# EasyEDA Pro project IoT_gateway_ver1A.epro

# Schematic Schematic

## Sheets
1 ESP32-S3-Mini-1U-N4R2: Board Name: Board1; Create Date: 2026-08-17; Page Name: P1; Project Name: ESP32-S3; Schematic Name: Schematic1; Update Date: 2026-08-17; Company: EasyEDA.com; Page Size: A4; Version: V1.0
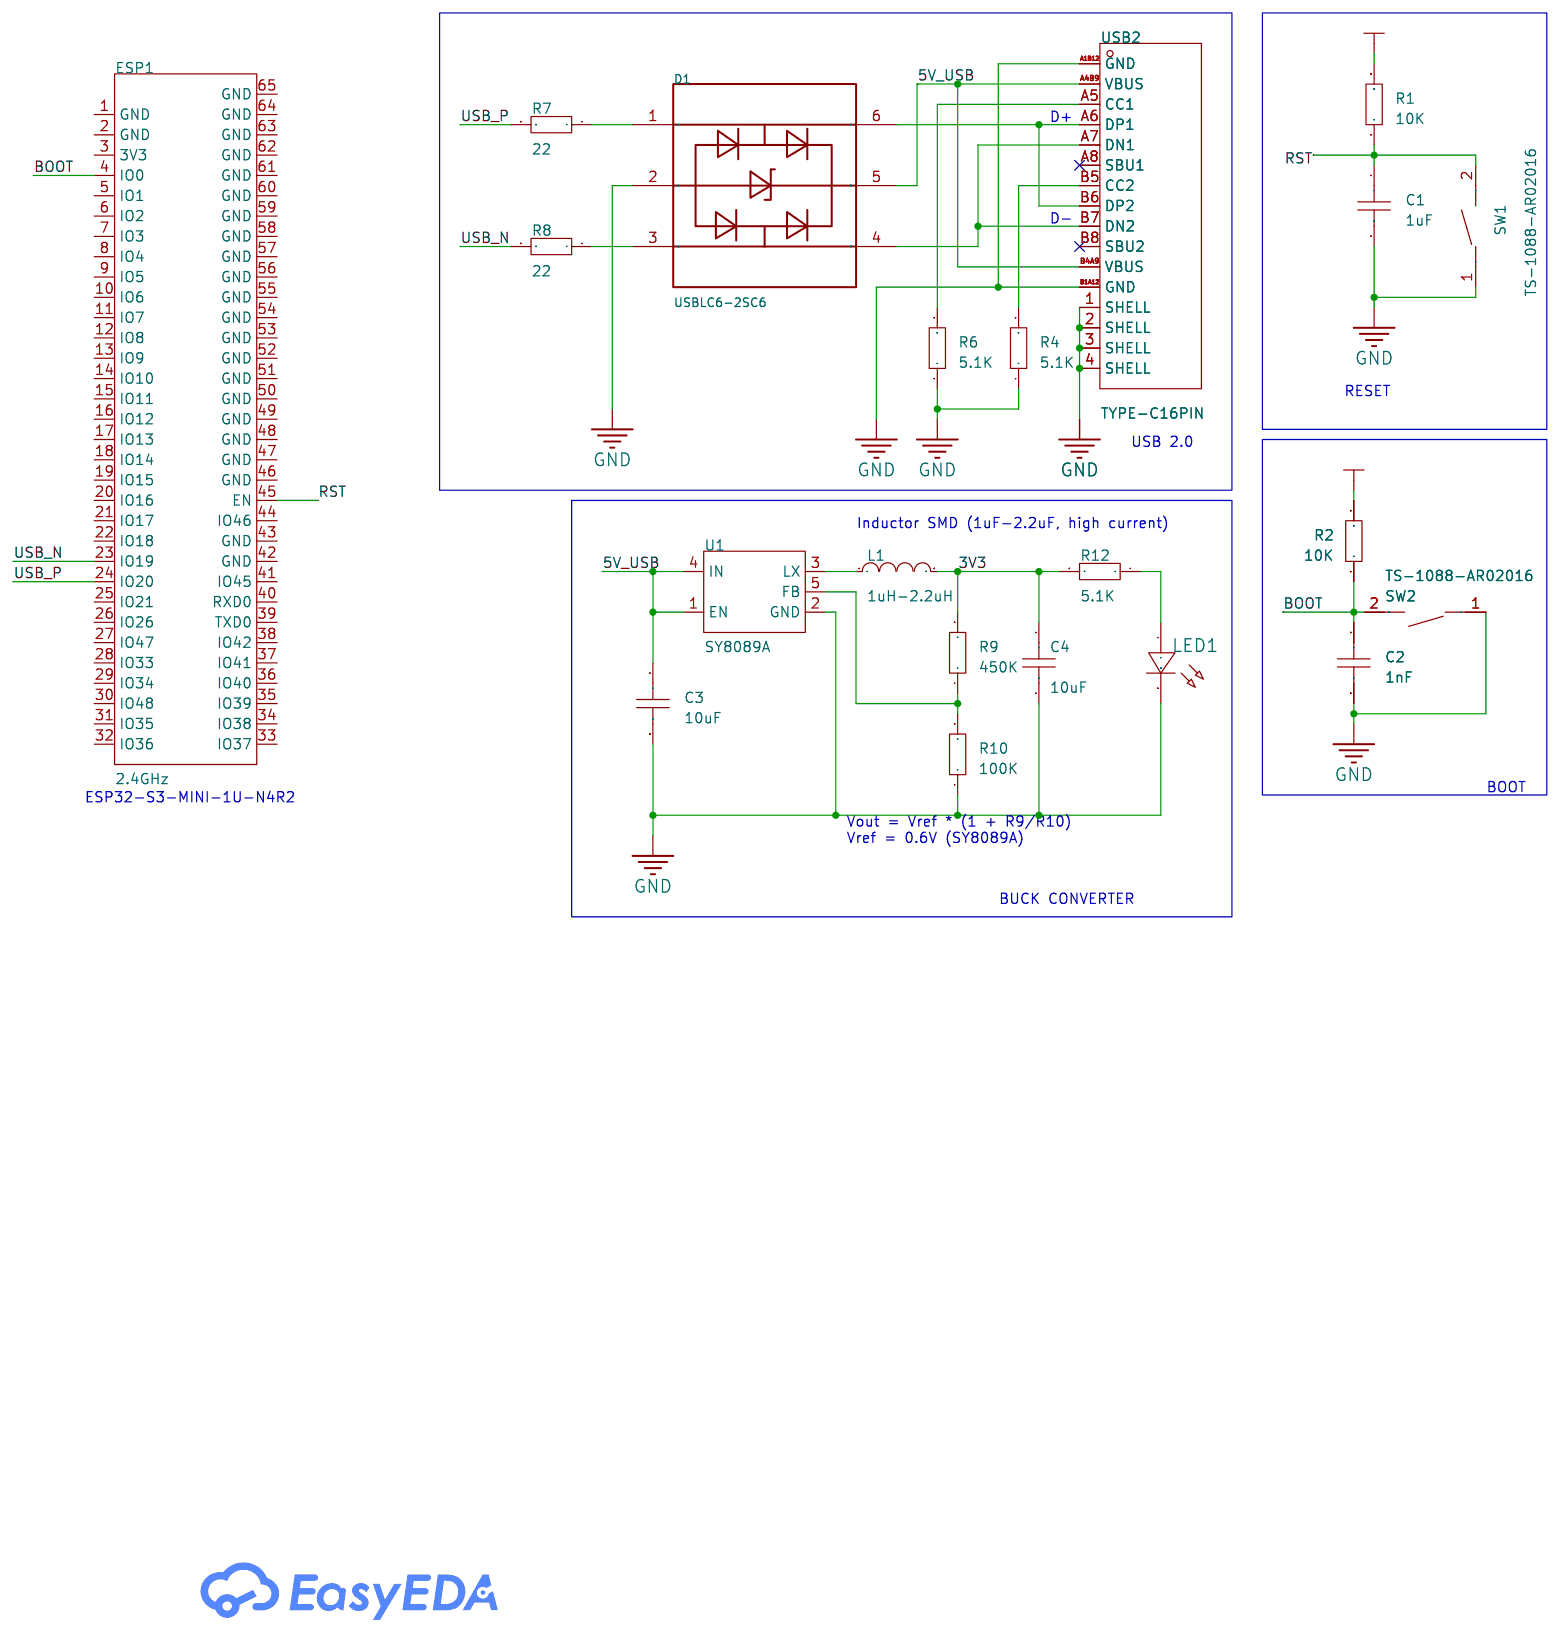
[diagram p0: ESP32-S3-Mini-1U-N4R2]
2 SIM7670G: Create Date: 2026-08-18; Page Name: SIM7670G; Schematic Name: Schematic; Update Date: 2026-08-21
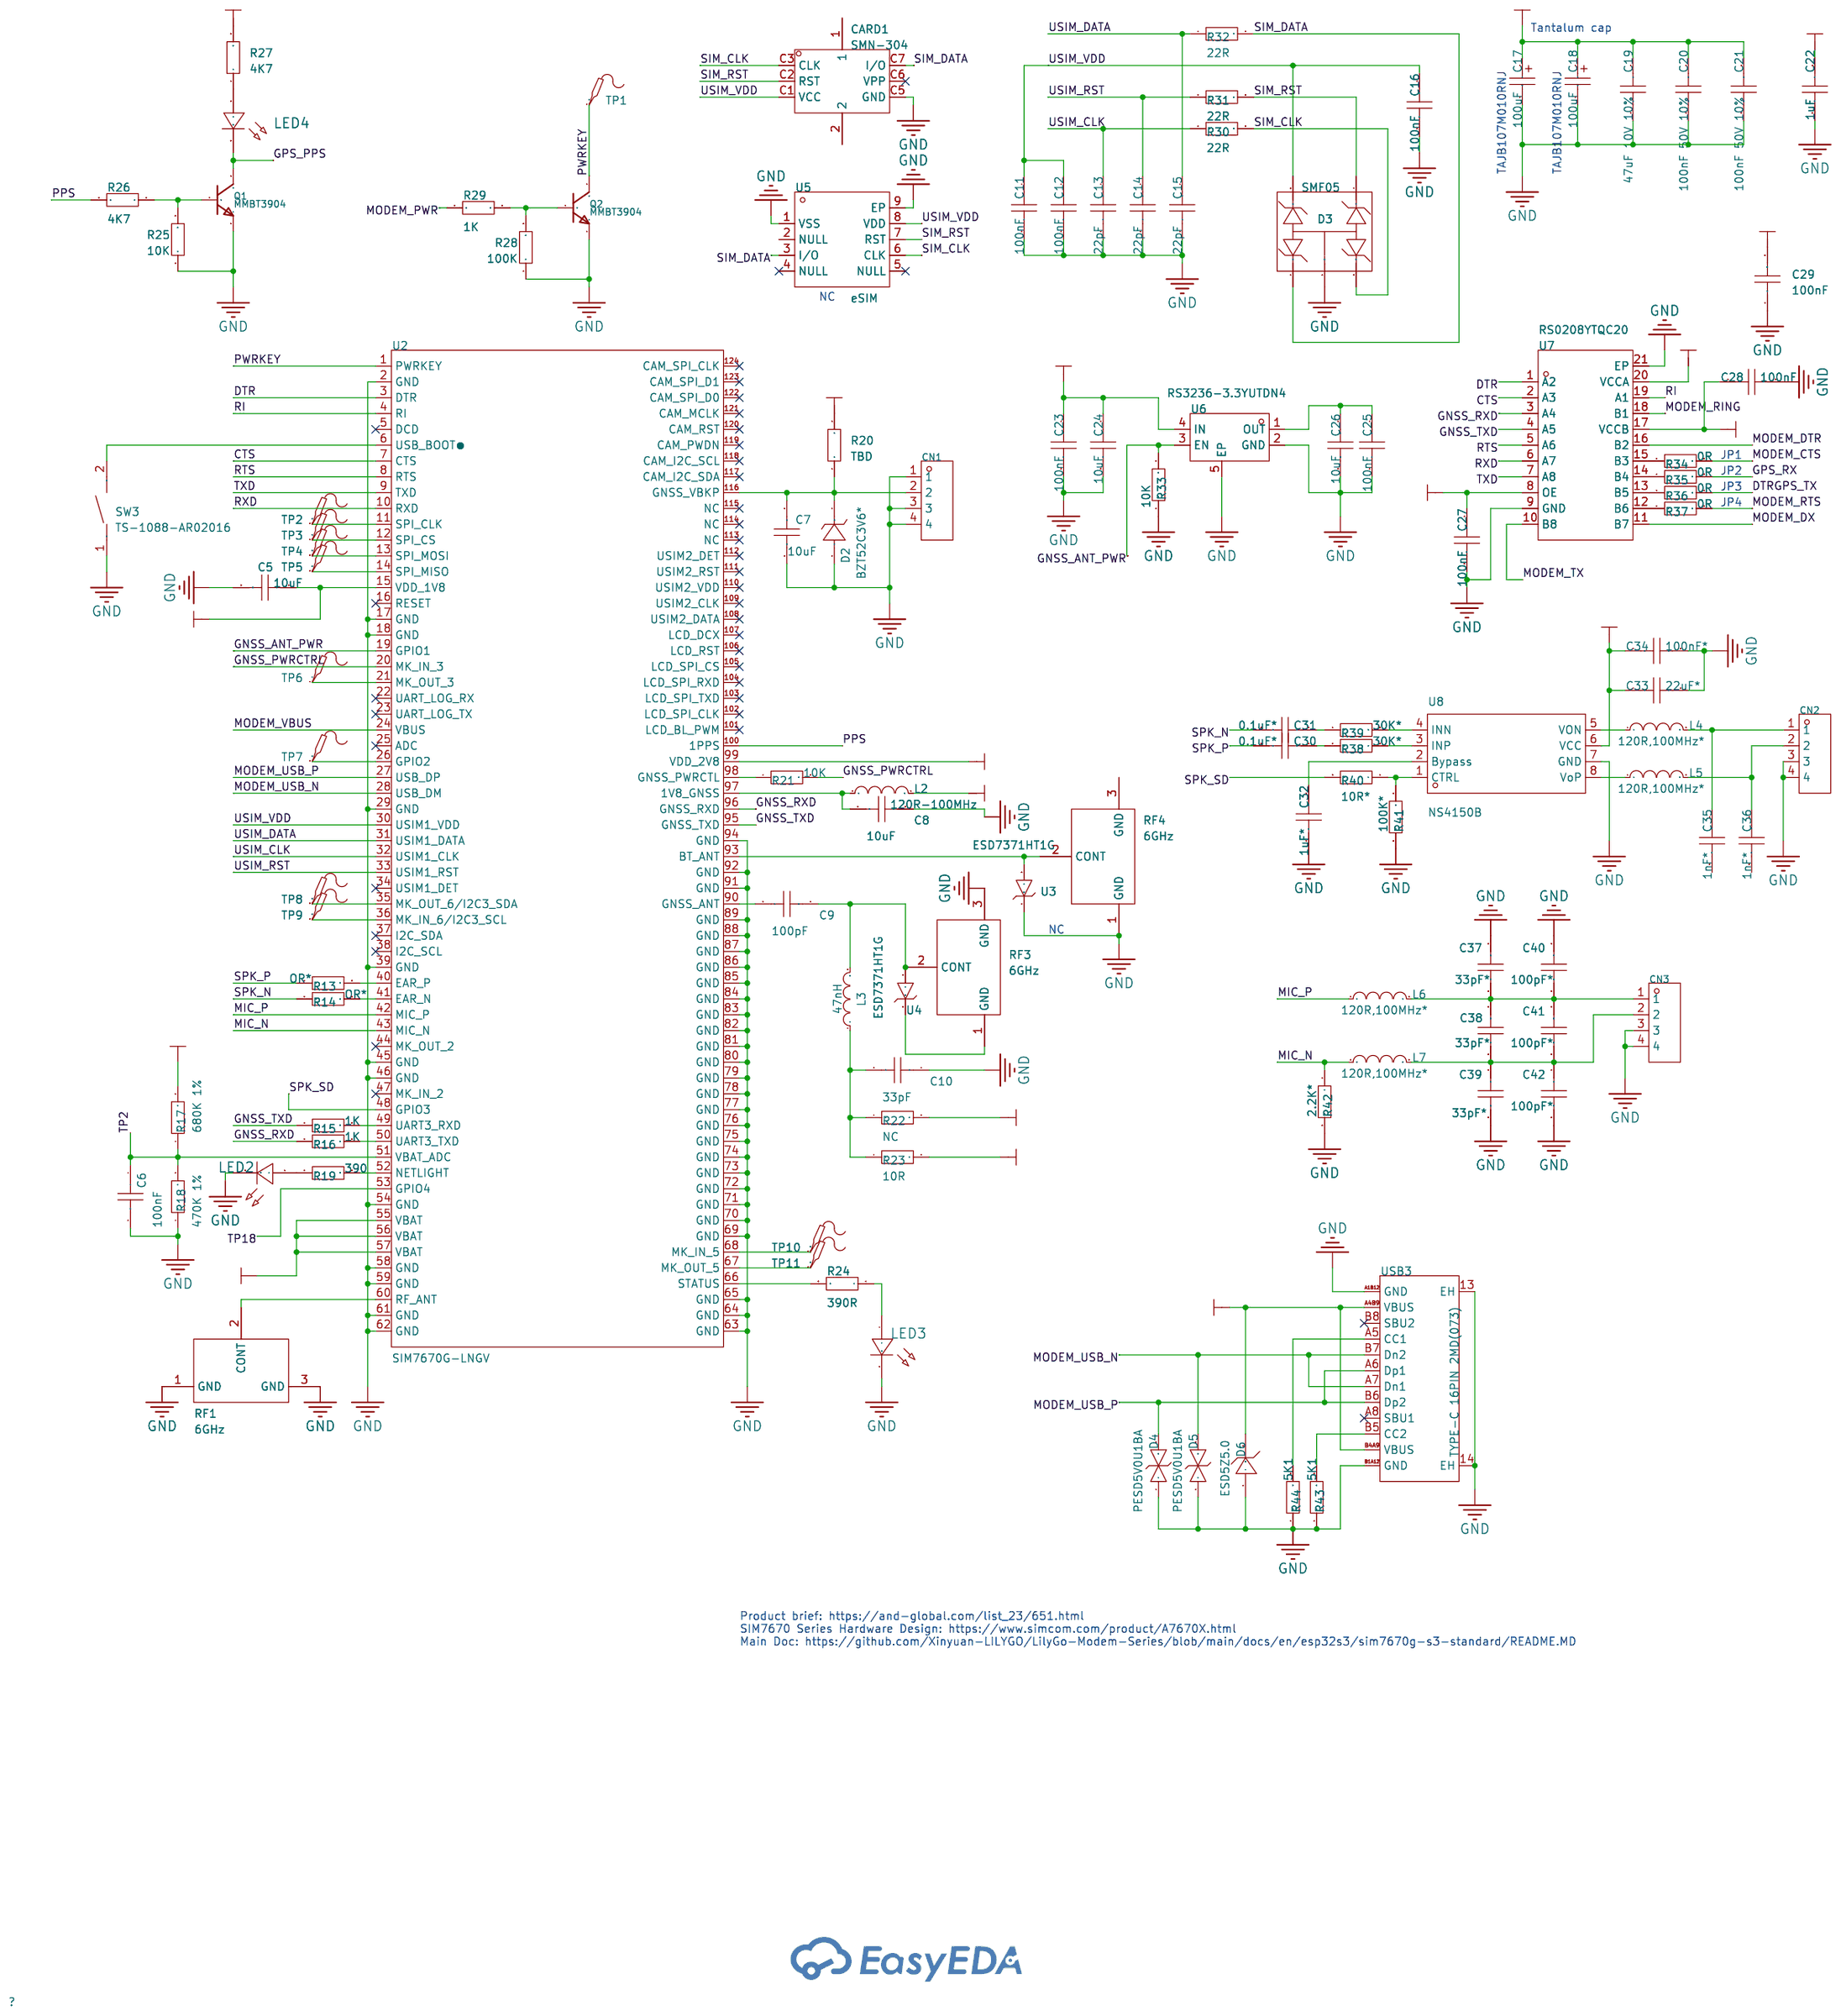
[diagram p1: SIM7670G]
3 Power source: Create Date: 2026-08-21; Page Name: Power source; Schematic Name: Schematic; Update Date: 2026-08-21
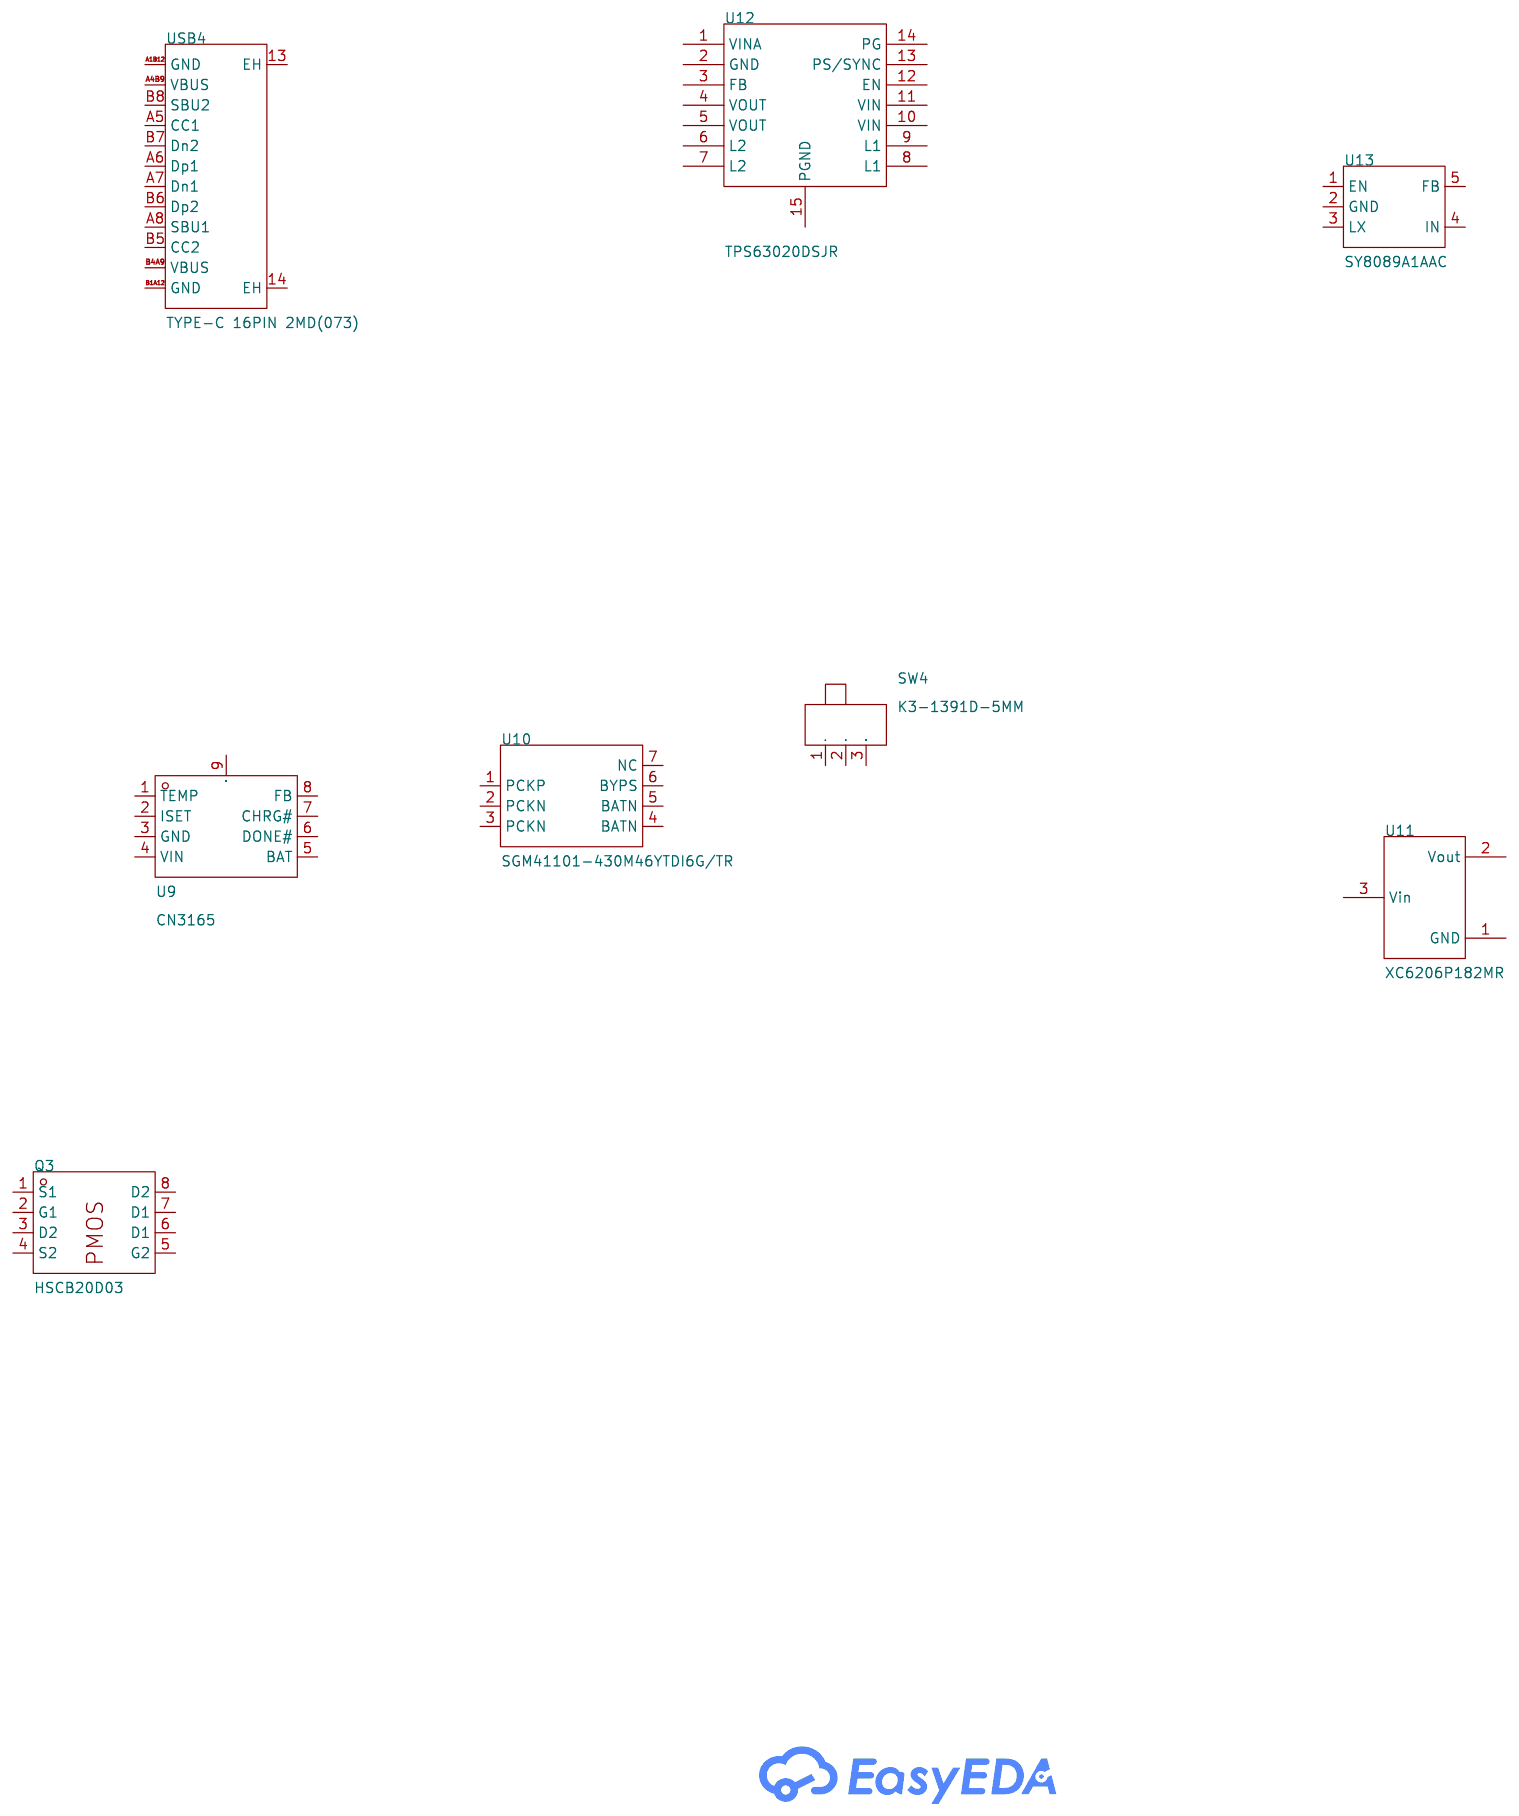
[diagram p2: Power source]
4 SX1262: Create Date: 2026-08-21; Project Name: Project Name; Schematic Name: Schematic Name; Update Date: 2021.11.05
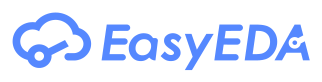
[diagram p3: SX1262]

## Parts
sheet ESP32-S3-Mini-1U-N4R2
C1  1uF  [C0603]
C2  1nF  [C0603]
C3  10uF  [C0603]
C4  10uF  [C0603]
D1  USBLC6-2SC6  [TSOT-23-6_L2.9-W1.6-P0.95-LS2.8-BR]
ESP1  2.4GHz  [BULETM-SMD_ESPRESSIF_ESP32-S3-MINI-1U-N8]
L1  1uH-2.2uH  [L0603]
LED1  -  [LED0402-RD_YELLOW]
R1  10K  [R0603]
R2  10K  [R0603]
R4  5.1K  [R0603]
R6  5.1K  [R0603]
R7  22  [R0603]
R8  22  [R0603]
R9  450K  [R0603]
R10  100K  [R0603]
R12  5.1K  [R0603]
SW1  TS-1088-AR02016  [SW-SMD_L3.9-W3.0-P4.45]
SW2  TS-1088-AR02016  [SW-SMD_L3.9-W3.0-P4.45]
U1  SY8089A  [SOT-23-5_L3.0-W1.7-P0.95-LS2.8-BL]
USB2  TYPE-C16PIN  [USB-C-SMD_TYPE-C16PIN]
sheet Power source
Q3  HSCB20D03  [DFN-6_L2.0-W2.0-P0.65-BL-EP2]
SW4  K3-1391D-5MM  [SW-TH_K3-1391D-5MM]
U9  CN3165  [DFN-8_L3.0-W3.0-P0.50-BL-EP]
U10  SGM41101-430M46YTDI6G/TR  [TDFN-6_L2.0-W2.0-P0.65-TL-EP1.4]
U11  XC6206P182MR  [SOT-23-3_L2.9-W1.6-P1.90-LS2.8-BR]
U12  TPS63020DSJR  [VSON-14_L4.0-W3.0-P0.50-BL-EP_TI_DSJ]
U13  SY8089A1AAC  [TSOT-23-5_L2.9-W1.6-P0.95-LS2.8-BR]
USB4  TYPE-C 16PIN 2MD(073)  [USB-C-SMD_TYPE-C-16PIN-2MD-073]
sheet SIM7670G
C5  10uF  [C0603]
C6  100nF  [C0603]
C7  10uF  [C0603]
C8  10uF  [C0603]
C9  100pF  [C0603]
C10  33pF  [C0603]
C11  100nF  [C0201]
C12  100nF  [C0201]
C13  22pF  [C0201]
C14  22pF  [C0201]
C15  22pF  [C0201]
C16  100nF  [C0201]
C17  100uF  [CASE-B_3528]
C18  100uF  [CASE-B_3528]
C19  47uF 10V 10%  [C0201]
C20  100nF 50V 10%  [C0201]
C21  100nF 50V 10%  [C0201]
C22  1uF  [C0201]
C23  100nF  [C0201]
C24  10uF  [C0201]
C25  100nF  [C0201]
C26  10uF  [C0201]
C27  100nF  [C0201]
C28  100nF  [C0201]
C29  100nF  [C0201]
C30  0.1uF*  [C0201]
C31  0.1uF*  [C0201]
C32  1uF*  [C0201]
C33  22uF*  [C0201]
C34  100nF*  [C0201]
C35  1nF*  [C0201]
C36  1nF*  [C0201]
C37  33pF*  [C0603]
C38  33pF*  [C0603]
C39  33pF*  [C0603]
C40  100pF*  [C0603]
C41  100pF*  [C0603]
C42  100pF*  [C0603]
CARD1  SMN-304  [SIM-SMD_SMN-304]
CN1  -  [HDR-TH_4P-P2.54-V-F]
CN2  -  [HDR-TH_4P-P2.54-V-F]
CN3  -  [HDR-TH_4P-P2.54-V-F]
D2  BZT52C3V6*  [SOD-123_L2.8-W1.8-LS3.7-RD]
D3  SMF05  [SOT-353_L2.0-W1.2-P0.65-LS2.1-BL-1]
D4  PESD5V0U1BA  [SOD-323_L1.8-W1.3-LS2.5-BI]
D5  PESD5V0U1BA  [SOD-323_L1.8-W1.3-LS2.5-BI]
D6  ESD5Z5.0  [SOD-523_L1.2-W0.8-LS1.6-RD]
L2  120R-100MHz  [L0603]
L3  47nH  [L0603]
L4  120R,100MHz*  [L0603]
L5  120R,100MHz*  [L0603]
L6  120R,100MHz*  [L0603]
L7  120R,100MHz*  [L0603]
LED2  -  [LED0402-RD_YELLOW]
LED3  -  [LED0402-RD_YELLOW]
LED4  -  [LED0402-RD_YELLOW]
Q1  MMBT3904  [SOT-23-3_L3.0-W1.7-P0.95-LS2.9-BR]
Q2  MMBT3904  [SOT-23-3_L3.0-W1.7-P0.95-LS2.9-BR]
R13  OR*  [R0603]
R14  OR*  [R0603]
R15  1K  [R0603]
R16  1K  [R0603]
R17  680K 1%  [R0603]
R18  470K 1%  [R0603]
R19  390  [R0603]
R20  TBD  [R0603]
R21  10K  [R0603]
R22  NC  [R0603]
R23  10R  [R0603]
R24  390R  [R0603]
R25  10K  [R0603]
R26  4K7  [R0603]
R27  4K7  [R0603]
R28  100K  [R0603]
R29  1K  [R0603]
R30  22R  [R0603]
R31  22R  [R0603]
R32  22R  [R0603]
R33  10K  [R0603]
R34  0R  [R0603]
R35  0R  [R0603]
R36  0R  [R0603]
R37  0R  [R0603]
R38  30K*  [R0603]
R39  30K*  [R0603]
R40  10R*  [R0603]
R41  100K*  [R0603]
R42  2.2K*  [R0603]
R43  5K1  [R0603]
R44  5K1  [R0603]
RF1  6GHz  [ANT-SMD_UFL-R-SMT01]
RF3  6GHz  [ANT-SMD_UFL-R-SMT01]
RF4  6GHz  [ANT-SMD_UFL-R-SMT01]
SW3  TS-1088-AR02016  [SW-SMD_L3.9-W3.0-P4.45]
TP1  -  [Test-Point-0.5mm]
TP2  -  [Test-Point-0.5mm]
TP3  -  [Test-Point-0.5mm]
TP4  -  [Test-Point-0.5mm]
TP5  -  [Test-Point-0.5mm]
TP6  -  [Test-Point-0.5mm]
TP7  -  [Test-Point-0.5mm]
TP8  -  [Test-Point-0.5mm]
TP9  -  [Test-Point-0.5mm]
TP10  -  [Test-Point-0.5mm]
TP11  -  [Test-Point-0.5mm]
U2  SIM7670G-LNGV  [LCC-124_L24.0-W24.0-P1.0-TL]
U3  ESD7371HT1G  [SOD-323_L1.7-W1.3-LS2.5-RD]
U4  ESD7371HT1G  [SOD-323_L1.7-W1.3-LS2.5-RD]
U5  eSIM  [DFN-8_L2.0-W2.0-P0.50-LS2.0-BL-EP]
U6  RS3236-3.3YUTDN4  [XDFN-4_L1.0-W1.0-P0.65-BL-EP]
U7  RS0208YTQC20  [QFN-20_L3.0-W3.0-P0.40-BL-EP1.7]
U8  NS4150B  [MSOP-8_L3.0-W3.0-P0.65-LS5.0-BL]
USB3  TYPE-C 16PIN 2MD(073)  [USB-C-SMD_TYPE-C-16PIN-2MD-073]

## Library data of the parts
C1-C10 C37-C42 = CAP_0603: Supplier Footprint: 0603
D1 = USBLC6-2SC6_C48971164: Reverse Stand-Off Voltage (Vrwm):5V Clamping Voltage:13V Peak Pulse Current (Ipp):6A@8/20us Peak Pulse Power Dissipation (Ppp):78W@8/20us Voltage - Breakdown:9V Reverse Leakage Current (Ir):100nA Number of Channels:2 Operating Temperature:-40℃~+125℃ Opera; LCSC Part Name: ESD 5V截止 峰值浪涌电流：6A@8/20us; Supplier Part: C48971164; Manufacturer: Slkor(萨科微); Supplier Footprint: SOT-23-6L; JLCPCB Part Class: Extended Part; Datasheet: https://item.szlcsc.com/datasheet/USBLC6-2SC6/51296793.html; Supplier: LCSC; Reverse Stand-Off Voltage (Vrwm): 5V; Clamping Voltage: 13V; Peak Pulse Current (Ipp): 6A@8/20us; Peak Pulse Power Dissipation (Ppp): 78W@8/20us; Voltage - Breakdown: 9V; Reverse Leakage Current (Ir): 100nA; Number of Channels: 2; Operating Temperature: -40℃~+125℃; level of protection: IEC 61000-4-2; Type: ESD; Junction Capacitance: 0.5pF；1pF
ESP1 = ESP32-S3-MINI-1U-N4R2: Utilized IC / Part:ESP32-S3FH4R2 Interface Type:I2C；UART；SPI；USB；I2S Frequency:2.4GHz Output Power:20.5dBm Output Power:20.5dBm Voltage - Supply:3V~3.6V Voltage - Supply:3V~3.6V Receive  Current:95mA Send  Current:355mA Sensitivity:-98.2dBm Sensitivity:-9; LCSC Part Name: 不带固件 小尺寸模组，集成2.4GHz Wi-Fi(802.11b/g/n)+Bluetooth 5(LE); Supplier Part: C22356044; Manufacturer: ESPRESSIF(乐鑫); Supplier Footprint: SMD,15.4x15.4mm; JLCPCB Part Class: Extended Part; Datasheet: https://item.szlcsc.com/datasheet/ESP32-S3-MINI-1U-N4R2/23788626.html; Supplier: LCSC; Utilized IC / Part: ESP32-S3FH4R2; Interface Type: I2C；UART；SPI；USB；I2S; Output Power: 20.5dBm; Voltage - Supply: 3V~3.6V; Receive  Current: 95mA; Send  Current: 355mA; Sensitivity: -98.2dBm; Operating Temperature: -40℃~+85℃
L1-L7 = L_0603
LED1-LED4 = LED_0402-R: Supplier Footprint: 0402
R1 R2 R4 R6-R10 R12-R44 = Res_0603: Supplier Footprint: 0603
SW1-SW3 = TS-1088-AR02016: Circuit:SPST Actuator Style:Round Button Operating Force:1.6N Mounting Type:Surface Mount,Vertical Length:3.9mm Width:3mm Switch Height:2mm with Bracket:Without Bracket Contact Current:50mA Voltage Rating:12V Actuator/Cap Color:Black With Lamp:- IP Rating; LCSC Part Name: 3.9*3*2mm 立贴 轻触开关; Supplier Part: C720477; Manufacturer: XUNPU(讯普); Supplier Footprint: SMD,4x3mm; JLCPCB Part Class: Basic Part; Datasheet: https://item.szlcsc.com/datasheet/TS-1088-AR02016/763484.html; Supplier: LCSC; Circuit: SPST; Actuator Style: Round Button; Operating Force: 1.6N; Mounting Type: Surface Mount,Vertical; Length: 3.9mm; Width: 3mm; Switch Height: 2mm; with Bracket: Without Bracket; Contact Current: 50mA; Voltage Rating: 12V; Actuator/Cap Color: Black; Termination Style: SMD(SMT) Tab; Life: 100,000 cycles; Operating Temperature: -30℃~+80℃
U1 = SY8089A: Function:Step-down type Voltage - Supply:2.5V~5.5V Voltage - Supply:2.5V~5.5V Output Voltage:- Output Voltage:- Output Current:2A Frequency - Switching:1MHz Frequency - Switching:1MHz Operating Temperature:-40℃~+125℃@(TJ) Operating Temperature:-40℃~+125℃@; LCSC Part Name: 降压型 2A 2.5V~5.5V; Supplier Part: C41348273; Manufacturer: TECH PUBLIC(台舟); Supplier Footprint: SOT-23-5; JLCPCB Part Class: Extended Part; Datasheet: https://item.szlcsc.com/datasheet/SY8089A/43078192.html; Supplier: LCSC; Function: Step-down type; Voltage - Supply: 2.5V~5.5V; Output Current: 2A; Frequency - Switching: 1MHz; Operating Temperature: -40℃~+125℃@(TJ); Synchronous Rectifier: No; Number of Outputs: 1; Topology: Buck; Quiescent Current: 50uA; Switch tube (built-in/external): Built-in; Output Type: Adjustable; Features: Cycle-by-cycle current limiting；Overcurrent Protection
USB2 = TYPE-C16PIN: Connector Type:Type-C Protocol Standard:- Gender:Female Mounting Type:Surface Mount, Right Angle Number of Contacts:16P Number of Ports:1 Current Rating-Power:3A Voltage Rating:30V Connect-Disconnect Life:10,000 Cycles Supplementary Features:- Center Heig; LCSC Part Name: 16P卧贴母座; Supplier Part: C393939; Manufacturer: SHOU HAN(首韩); Supplier Footprint: SMD; JLCPCB Part Class: Extended Part; Datasheet: https://item.szlcsc.com/datasheet/TYPE-C16PIN/372551.html; Supplier: LCSC; Connector Type: Type-C; Gender: Female; Mounting Type: Surface Mount, Right Angle; Number of Contacts: 16P; Number of Ports: 1; Current Rating-Power: 3A; Voltage Rating: 30V; Connect-Disconnect Life: 10,000 Cycles; Detection color: Black; Operating Temperature: -40℃~+85℃
Q3 = HSCB20D03: Number:2 P-Channel Drain to Source Voltage:20V Current - Continuous Drain(Id):3A RDS(on):100mΩ@4.5V Pd - Power Dissipation:1.5W Gate Threshold Voltage (Vgs(th)):1.2V@250uA Gate Charge(Qg):3.3nC@10V Input Capacitance(Ciss):331pF@10V Reverse Transfer Capaci; LCSC Part Name: 2个P沟道 耐压:20V 电流:3A; Supplier Part: C2828494; Manufacturer: HUASHUO(华朔); Supplier Footprint: DFN-6-EP(2x2); JLCPCB Part Class: Extended Part; Datasheet: https://item.szlcsc.com/datasheet/HSCB20D03/2976498.html; Supplier: LCSC; Number: 2 P-Channel; Drain to Source Voltage: 20V; Current - Continuous Drain(Id): 3A; RDS(on): 100mΩ@4.5V; Pd - Power Dissipation: 1.5W; Gate Threshold Voltage (Vgs(th)): 1.2V@250uA; Gate Charge(Qg): 3.3nC@10V; Input Capacitance(Ciss): 331pF@10V; Reverse Transfer Capacitance (Crss@Vds): 37pF; Operating Temperature: -55℃~+150℃; Type: P-Channel; Output Capacitance(Coss): 64pF
SW4 = K3-1391D-5MM: Circuit:SPDT Actuator Style:Rectangular Columnar Termination Style:PC Pin Length:13.3mm Width:6mm Switch Height:6.6mm Mounting Type:Through Hole Actuator Color:Black Current Rating:3A Voltage Rating:120V Life:30,000 Cycles Operating Temperature:-25℃~+80℃; LCSC Part Name: 直插双档 滑动开关; Supplier Part: C970579; Manufacturer: 韩国韩荣; Supplier Footprint: 插件,13.3x6mm; JLCPCB Part Class: Extended Part; Datasheet: https://item.szlcsc.com/datasheet/K3-1391D-5MM/1060209.html; Supplier: LCSC; Circuit: SPDT; Actuator Style: Rectangular Columnar; Termination Style: PC Pin; Length: 13.3mm; Width: 6mm; Switch Height: 6.6mm; Mounting Type: Through Hole; Actuator Color: Black; Current Rating: 3A; Voltage Rating: 120V; Life: 30,000 Cycles; Operating Temperature: -25℃~+80℃
U9 = CN3165: The Chip Type:Charging IC Voltage - Supply:4.4V~6V Voltage - Supply:4.4V~6V Charge Current - Max:- Charging Saturation Voltage:4.2V End-Off Voltage:- Type of Battery:Lithium Battery Number of Cells:1 Number of Cells:1 Operating Temperature:-40℃~+85℃ Opera; LCSC Part Name: 可用太阳能板供电的锂电池充电管理芯片; Supplier Part: C559035; Manufacturer: CONSONANCE(上海如韵); Supplier Footprint: DFN-8-EP(3x3); JLCPCB Part Class: Extended Part; Datasheet: https://item.szlcsc.com/datasheet/CN3165/582675.html; Supplier: LCSC; The Chip Type: Charging IC; Voltage - Supply: 4.4V~6V; Charging Saturation Voltage: 4.2V; Type of Battery: Lithium Battery; Number of Cells: 1; Operating Temperature: -40℃~+85℃; Battery Temperature Detection: Support; Supply Current (Iq): 3uA
U10 = SGM41101-430M46YTDI6G/TR: The Chip Type:Protection IC Voltage - Supply:0V~6V Voltage - Supply:0V~6V Charge Current - Max:3.6A Charging Saturation Voltage:4.3V End-Off Voltage:2.4V Type of Battery:Lithium Battery Number of Cells:1 Number of Cells:1 Operating Temperature:-40℃~+85℃ O; LCSC Part Name: 真单片式锂离子/锂聚合物电池薄型保护器; Supplier Part: C5153737; Manufacturer: SGMICRO(圣邦微); Supplier Footprint: TDFN-6L(2x2); JLCPCB Part Class: Extended Part; Datasheet: https://item.szlcsc.com/datasheet/SGM41101-430M46YTDI6G%252FTR/5780465.html; Supplier: LCSC; The Chip Type: Protection IC; Voltage - Supply: 0V~6V; Charge Current - Max: 3.6A; Charging Saturation Voltage: 4.3V; End-Off Voltage: 2.4V; Type of Battery: Lithium Battery; Number of Cells: 1; Operating Temperature: -40℃~+85℃; Battery Temperature Detection: Not supported; Supply Current (Iq): 1uA
U11 = XC6206P182MR_C51886219: Output Configuration:Positive Voltage - Supply:6V Output Voltage:1.8V Output Voltage:1.8V Output Current:250mA Power Supply Rejection Ratio (PSRR):45dB@(1kHz) Voltage Dropout:300mV@(50mA) standby current:6uA Noise:- Features:Over Current Protection；Therma; LCSC Part Name: 1.8V 250mA 6V; Supplier Part: C51886219; Manufacturer: TECH PUBLIC(台舟); Supplier Footprint: SOT-23; JLCPCB Part Class: Extended Part; Datasheet: https://item.szlcsc.com/datasheet/XC6206P182MR/54557105.html; Supplier: LCSC; Output Configuration: Positive; Voltage - Supply: 6V; Output Voltage: 1.8V; Output Current: 250mA; Power Supply Rejection Ratio (PSRR): 45dB@(1kHz); Voltage Dropout: 300mV@(50mA); standby current: 6uA; Features: Over Current Protection；Thermal shutdown; Operating Temperature: -40℃~+125℃; Output Type: Fixed; Number of Outputs: 1
U12 = TPS63020DSJR: Function:Boost type Output Type:Adjustable Voltage - Supply:1.8V~5.5V Voltage - Supply:1.8V~5.5V Output Voltage:1.2V~5.5V Output Voltage:1.2V~5.5V Output Current:3A Frequency - Switching:2.4MHz Frequency - Switching:2.4MHz Operating Temperature:-40℃~+85℃@; LCSC Part Name: 高效率单电感升降压转换器; Supplier Part: C15483; Manufacturer: TI(德州仪器); Supplier Footprint: VSON-14-EP(3x4); JLCPCB Part Class: Extended Part; Datasheet: https://www.ti.com/cn/lit/gpn/tps63020; Supplier: LCSC; Function: Boost type; Output Type: Adjustable; Voltage - Supply: 1.8V~5.5V; Output Voltage: 1.2V~5.5V; Output Current: 3A; Frequency - Switching: 2.4MHz; Operating Temperature: -40℃~+85℃@(TA); Synchronous Rectifier: Yes; Number of Outputs: 1; Topology: Step-down-Boost; Quiescent Current: 50uA; Switch tube (built-in/external): Built-in
U13 = SY8089A1AAC: Function:Step-down type Voltage - Supply:2.5V~5.5V Voltage - Supply:2.5V~5.5V Output Voltage:- Output Voltage:- Output Current:2A Frequency - Switching:1.5MHz Frequency - Switching:1.5MHz Operating Temperature:-40℃~+125℃@(TA/TJ) Operating Temperature:-40℃; LCSC Part Name: 降压型 2A 2.5V~5.5V; Supplier Part: C479074; Manufacturer: Silergy(矽力杰); Supplier Footprint: SOT-23-5; JLCPCB Part Class: Extended Part; Datasheet: https://item.szlcsc.com/datasheet/SY8089A1AAC/486366.html; Supplier: LCSC; Function: Step-down type; Voltage - Supply: 2.5V~5.5V; Output Current: 2A; Frequency - Switching: 1.5MHz; Operating Temperature: -40℃~+125℃@(TA/TJ); Synchronous Rectifier: Yes; Number of Outputs: 1; Topology: Buck; Quiescent Current: 50uA; Switch tube (built-in/external): Built-in; Output Type: Adjustable; Features: Output discharge；Hiccup current limiting
USB3 USB4 = TYPE-C 16PIN 2MD(073): Connector Type:Type-C Protocol Standard:- Gender:Female Mounting Type:Surface Mount, Right Angle Number of Contacts:16P Number of Ports:1 Current Rating-Power:3A Voltage Rating:5V Connect-Disconnect Life:10,000 cycles Supplementary Features:- Center Heigh; LCSC Part Name: Type-C 母 卧贴; Supplier Part: C2765186; Manufacturer: SHOU HAN(首韩); Supplier Footprint: SMD; JLCPCB Part Class: Extended Part; Datasheet: https://item.szlcsc.com/datasheet/TYPE-C%252016PIN%25202MD(073)/2901843.html; Supplier: LCSC; Connector Type: Type-C; Gender: Female; Mounting Type: Surface Mount, Right Angle; Number of Contacts: 16P; Number of Ports: 1; Current Rating-Power: 3A; Voltage Rating: 5V; Connect-Disconnect Life: 10,000 cycles; Detection color: Black; Operating Temperature: -25℃~+85℃
C11-C16 C19-C36 = CAP_0201: Supplier Footprint: 0201
C17 C18 = TAJB107M010RNJ: Capacitance:100uF Tolerance:±20% Tolerance:±20% Voltage Rating:10V Equivalent Series Resistance(ESR):1.4Ω@100kHz Operating Temperature:-55℃~+125℃ Operating Temperature:-55℃~+125℃; LCSC Part Name: 100uF ±20% 10V; Supplier Part: C7196; Manufacturer: Kyocera AVX; Supplier Footprint: CASE-B-3528-21(mm); JLCPCB Part Class: Extended Part; Supplier: LCSC; Tolerance: ±20%; Voltage Rating: 10V; Equivalent Series Resistance(ESR): 1.4Ω@100kHz; Operating Temperature: -55℃~+125℃
CARD1 = SMN-304: Card Connection Mode:Push-Pull Card Type:Nano-SIM Card Connector Type:Connector and Ejector Card Detection:- Supplementary Features:- Height Above Board:1.35mm Operating Temperature:-40℃~+85℃ Operating Temperature:-40℃~+85℃; LCSC Part Name: 拔插式 NanoSIM卡 卡座; Supplier Part: C266889; Manufacturer: XUNPU(讯普); Supplier Footprint: SMD; JLCPCB Part Class: Extended Part; Datasheet: https://item.szlcsc.com/datasheet/SMN-304/257000.html; Supplier: LCSC; Card Connection Mode: Push-Pull; Card Type: Nano-SIM Card; Connector Type: Connector and Ejector; Height Above Board: 1.35mm; Operating Temperature: -40℃~+85℃
CN1-CN3 = HDR-F_2.54_1x4P: Supplier Footprint: Through
D2 = BZT52C3V6_C49652771: Diode Configuration:1 Independent Zener Voltage(Nom):3.6V Reverse Leakage Current (Ir):5uA@1V Zener Voltage(Range):3.4V~3.8V Zener Voltage(Range):3.4V~3.8V Pd - Power Dissipation:350mW Impedance(Zzt):90Ω Impedance(Zzk):600Ω Operating Junction Temperature; LCSC Part Name: 3.6V 5uA@1.0V; Supplier Part: C49652771; Manufacturer: PAKER(派克微); Supplier Footprint: SOD-123; JLCPCB Part Class: Extended Part; Datasheet: https://item.szlcsc.com/datasheet/BZT52C3V6/52209955.html; Supplier: LCSC; Diode Configuration: 1 Independent; Zener Voltage(Nom): 3.6V; Reverse Leakage Current (Ir): 5uA@1V; Zener Voltage(Range): 3.4V~3.8V; Pd - Power Dissipation: 350mW; Impedance(Zzt): 90Ω; Impedance(Zzk): 600Ω
D3 = SMF05: Polarity:Unidirectional Reverse Stand-Off Voltage (Vrwm):5V Clamping Voltage:12V Peak Pulse Current (Ipp):8A Peak Pulse Power Dissipation (Ppp):100W Voltage - Breakdown:8.5V Reverse Leakage Current (Ir):200nA Number of Channels:Four channels Operating Tem; LCSC Part Name: 单向TVS 5V截止 峰值浪涌电流：8A; Supplier Part: C5143686; Manufacturer: WPMtek(维攀); Supplier Footprint: SOT-353; JLCPCB Part Class: Extended Part; Datasheet: https://item.szlcsc.com/datasheet/SMF05/5763723.html; Supplier: LCSC; Polarity: Unidirectional; Reverse Stand-Off Voltage (Vrwm): 5V; Clamping Voltage: 12V; Peak Pulse Current (Ipp): 8A; Peak Pulse Power Dissipation (Ppp): 100W; Voltage - Breakdown: 8.5V; Reverse Leakage Current (Ir): 200nA; Number of Channels: Four channels; Operating Temperature: -55℃~+125℃; level of protection: IEC 61000-4-5；IEC 61000-4-2; Type: TVS; Junction Capacitance: 60pF
D4 D5 = PESD5V0U1BA_C5199862: Polarity:Bidirectional Reverse Stand-Off Voltage (Vrwm):5V Clamping Voltage:- Peak Pulse Current (Ipp):- Peak Pulse Power Dissipation (Ppp):- Voltage - Breakdown:7V Reverse Leakage Current (Ir):5nA Number of Channels:1 Operating Temperature:- Operating Te; LCSC Part Name: 双向ESD 5V截止; Supplier Part: C5199862; Manufacturer: UMW(友台半导体); Supplier Footprint: SOD-323; JLCPCB Part Class: Extended Part; Datasheet: https://item.szlcsc.com/datasheet/PESD5V0U1BA/5885894.html; Supplier: LCSC; Polarity: Bidirectional; Reverse Stand-Off Voltage (Vrwm): 5V; Voltage - Breakdown: 7V; Reverse Leakage Current (Ir): 5nA; Number of Channels: 1; level of protection: IEC 61000-4-2; Type: ESD; Junction Capacitance: 2.9pF
D6 = ESD5Z5.0: Polarity:Unidirectional Reverse Stand-Off Voltage (Vrwm):5V Clamping Voltage:18.6V Peak Pulse Current (Ipp):9.4A Peak Pulse Power Dissipation (Ppp):200W@8/20us Voltage - Breakdown:6.2V Reverse Leakage Current (Ir):1uA Operating Temperature:-40℃~+125℃ Oper; LCSC Part Name: 200W单向表面贴装ESD二极管; Supplier Part: C397782; Manufacturer: AnBon(安邦); Supplier Footprint: SOD-523; JLCPCB Part Class: Extended Part; Datasheet: https://item.szlcsc.com/datasheet/ESD5Z5.0/379305.html; Supplier: LCSC; Polarity: Unidirectional; Reverse Stand-Off Voltage (Vrwm): 5V; Clamping Voltage: 18.6V; Peak Pulse Current (Ipp): 9.4A; Peak Pulse Power Dissipation (Ppp): 200W@8/20us; Voltage - Breakdown: 6.2V; Reverse Leakage Current (Ir): 1uA; Operating Temperature: -40℃~+125℃; level of protection: IEC 61000-4-4；IEC 61000-4-5；IEC 61000-4-2; Type: ESD; Junction Capacitance: 80pF
Q1 Q2 = MMBT3904_C55258612: LCSC Part Name: NPN三极管; Supplier Part: C55258612; Manufacturer: ALJ(龙晶微); Supplier Footprint: SOT-23; JLCPCB Part Class: Extended Part; Datasheet: https://item.szlcsc.com/datasheet/MMBT3904/59148508.html; Supplier: LCSC
RF1 RF3 RF4 = U.FL-R-SMT(01): Connector Type:Board Side Interface:Male Pin Number of Ports:1 Interface Diameter:2mm Interface Length/Height:1.25mm Frequency:6GHz RF Series:IPEX Impedance:50Ω Style:- Operating Temperature Range:-40℃~+90℃ Operating Temperature Range:-40℃~+90℃; LCSC Part Name: IPEX 内针; Supplier Part: C434812; Manufacturer: HRS(广濑); Supplier Footprint: SMD; JLCPCB Part Class: Extended Part; Datasheet: https://item.szlcsc.com/datasheet/U.FL-R-SMT(01)/432323.html; Supplier: LCSC; Connector Type: Board Side; Interface: Male Pin; Number of Ports: 1; Interface Diameter: 2mm; Interface Length/Height: 1.25mm; RF Series: IPEX; Impedance: 50Ω; Operating Temperature Range: -40℃~+90℃
TP1-TP11 = Test-Point: Test Point 测试点
U2 = SIM7670G-LNGV: Communication System:TDD-LTE；FDD-LTE Interface:I2C；UART；USB；GPIO Voltage - Supply:3.4V~4.2V Voltage - Supply:3.4V~4.2V Current Consumption:800uA Features:DFOTA function Operating Temperature:-30℃~+75℃ Operating Temperature:-30℃~+75℃; LCSC Part Name: LTE Cat 1bis模块; Supplier Part: C45935408; Manufacturer: SIMCOM(芯讯通无线科技); Supplier Footprint: SMD,24x24mm; JLCPCB Part Class: Extended Part; Datasheet: https://item.szlcsc.com/datasheet/SIM7670G-LNGV/48042558.html; Supplier: LCSC; Communication System: TDD-LTE；FDD-LTE; Interface: I2C；UART；USB；GPIO; Voltage - Supply: 3.4V~4.2V; Current Consumption: 800uA; Features: DFOTA function; Operating Temperature: -30℃~+75℃
U3 U4 = ESD7371HT1G: Reverse Stand-Off Voltage (Vrwm):5.3V Clamping Voltage:20V Voltage - Breakdown:7V Reverse Leakage Current (Ir):50nA Number of Channels:1 level of protection:IEC 61000-4-2 Type:ESD Junction Capacitance:0.7pF; LCSC Part Name: ESD 5.3V截止; Supplier Part: C890628; Manufacturer: onsemi(安森美); Supplier Footprint: SOD-323; JLCPCB Part Class: Extended Part; Datasheet: https://item.szlcsc.com/datasheet/ESD7371HT1G/956098.html; Supplier: LCSC; Reverse Stand-Off Voltage (Vrwm): 5.3V; Clamping Voltage: 20V; Voltage - Breakdown: 7V; Reverse Leakage Current (Ir): 50nA; Number of Channels: 1; level of protection: IEC 61000-4-2; Type: ESD; Junction Capacitance: 0.7pF
U5 = eSIM: Supplier Part: C9900092443; Supplier Footprint: DFN2*2-8; JLCPCB Part Class: Extended Part; Supplier: LCSC
U6 = RS3236-3.3YUTDN4: Output Type:Fixed Voltage - Supply:7.5V Output Voltage:3.3V Output Voltage:3.3V Output Current:500mA Power Supply Rejection Ratio (PSRR):70dB@(1kHz) Voltage Dropout:550mV@(300mA) standby current:20uA Noise:80uVrms Features:Over Current Protection；Enable；O; LCSC Part Name: 输入7.5V 输出3.3V 500mA; Supplier Part: C379350; Manufacturer: RUNIC(润石); Supplier Footprint: UTDFN-1x1-4; JLCPCB Part Class: Extended Part; Datasheet: https://item.szlcsc.com/datasheet/RS3236-3.3YUTDN4/351762.html; Supplier: LCSC; Output Type: Fixed; Voltage - Supply: 7.5V; Output Voltage: 3.3V; Output Current: 500mA; Power Supply Rejection Ratio (PSRR): 70dB@(1kHz); Voltage Dropout: 550mV@(300mA); standby current: 20uA; Noise: 80uVrms; Features: Over Current Protection；Enable；Over Temperature Protection; Operating Temperature: -40℃~+85℃@(Tj); Output Configuration: Positive; Number of Outputs: 1
U7 = RS0208YTQC20: Supplier Part: C5372428; Manufacturer: RUNIC(润石); Supplier Footprint: QFN-20L(3x3); JLCPCB Part Class: Extended Part; Datasheet: https://item.szlcsc.com/datasheet/RS0208YTQC20/6223480.html; Supplier: LCSC
U8 = NS4150B_C189961: Class:Class D Output Power:3Wx1@4Ω Voltage - Supply:3V~5.25V Voltage - Supply:3V~5.25V; Supplier Part: C189961; Manufacturer: Nsiway(纳芯威); Supplier Footprint: MSOP-8; JLCPCB Part Class: Extended Part; Datasheet: https://item.szlcsc.com/datasheet/NS4150B/207582.html; Supplier: LCSC; Class: Class D; Output Power: 3Wx1@4Ω; Voltage - Supply: 3V~5.25V

## Nets
3.3V: R1.2 R2.2
3V3: C4.1 L1.2 R9.2 R12.2
5V_USB: C3.1 D1.5(VBUS) U1.1(EN) U1.4(IN) USB2.A4B9(VBUS) USB2.B4A9(VBUS)
+1.8V: C5.1 U2.15(VDD_1V8)
+1V8: C27.1 C29.2 L2.2 U7.8(OE) U7.20(VCCA)
+3V3: C28.1 R27.2 U7.17(VCCB)
+3V6: C17.1 C18.1 C19.1 C20.1 C21.1 C23.1 C24.1 C33.1 C34.1 U2.55(VBAT) U2.56(VBAT) U2.57(VBAT) U6.4(IN) U8.6(VCC)
GND: C1.2 C2.2 C3.2 C4.2 C5.2 C6.2 C7.2 C8.1 C10.1 C11.2 C12.2 C13.2 C14.2 C15.2 C16.2 C17.2 C18.2 C19.2 C20.2 C21.2 C22.2 C23.2 C24.2 C25.2 C26.2 C27.2 C28.2 C29.1 C32.2 C33.2 C34.2 C37.1 C39.2 C40.1 C42.2 CARD1.C5(GND) CN1.1 CN1.3 CN1.4 CN2.3 CN2.4 CN3.3 CN3.4 D1.2(GND) D2.2(A) D3.2 D4.1 D5.1 D6.2(A) LED1.2(C) LED2.2(C) LED3.2(C) Q1.2(E) Q2.2(E) R4.1 R6.1 R10.1 R18.1 R25.1 R28.1 R33.1 R41.2 R42.2 R43.1 R44.1 RF1.1(GND) RF1.3(GND) RF3.3(GND) RF4.1(GND) SW1.1 SW2.1 SW3.1 U1.2(GND) U2.2(GND) U2.17(GND) U2.18(GND) U2.29(GND) U2.39(GND) U2.45(GND) U2.46(GND) U2.54(GND) U2.58(GND) U2.59(GND) U2.61(GND) U2.62(GND) U2.63(GND) U2.64(GND) U2.65(GND) U2.69(GND) U2.70(GND) U2.71(GND) U2.72(GND) U2.73(GND) U2.74(GND) U2.75(GND) U2.76(GND) U2.77(GND) U2.78(GND) U2.79(GND) U2.80(GND) U2.81(GND) U2.82(GND) U2.83(GND) U2.84(GND) U2.85(GND) U2.86(GND) U2.87(GND) U2.88(GND) U2.89(GND) U2.91(GND) U2.92(GND) U2.94(GND) U3.1(C) U5.1(VSS) U5.9(EP) U6.2(GND) U6.5(EP) U7.9(GND) U7.21(EP) U8.7(GND) USB2.1(SHELL) USB2.2(SHELL) USB2.3(SHELL) USB2.4(SHELL) USB2.A1B12(GND) USB2.B1A12(GND) USB3.13(EH) USB3.14(EH) USB3.A1B12(GND) USB3.B1A12(GND)
VBAT: R17.2
VDD_AUX: C22.1 R22.2 U2.99(VDD_2V8)
VDD_GPS: R20.2 R23.2
BOOT: C2.1 ESP1.4(IO0) R2.1 SW2.2
CTS: U2.7(CTS) U7.2(A3)
DTR: U2.3(DTR) U7.1(A2)
DTRGPS_TX: R36.2
GNSS_ANT_PWR: R33.2 U2.19(GPIO1) U6.3(EN)
GNSS_PWRCTRL: R21.2 U2.20(MK_IN_3)
GNSS_RXD: R16.1 U2.96(GNSS_RXD) U7.3(A4)
GNSS_TXD: R15.1 U2.95(GNSS_TXD) U7.4(A5)
GPS_PPS: LED4.2(C) Q1.3(C)
GPS_RX: R35.2
MIC_N: L7.1 R42.1 U2.43(MIC_N)
MIC_P: L6.1 U2.42(MIC_P)
MODEM_CTS: R34.2
MODEM_DTR: U7.16(B2)
MODEM_DX: U7.11(B7)
MODEM_PWR: R29.2
MODEM_RING: U7.18(B1)
MODEM_RTS: R37.2
MODEM_TX: U7.10(B8)
MODEM_USB_N: D5.2 U2.28(USB_DM) USB3.A7(Dn1) USB3.B7(Dn2)
MODEM_USB_P: D4.2 U2.27(USB_DP) USB3.A6(Dp1) USB3.B6(Dp2)
MODEM_VBUS: D6.1(C) U2.24(VBUS) USB3.A4B9(VBUS) USB3.B4A9(VBUS)
PPS: R26.2 U2.100(1PPS)
PWRKEY: Q2.3(C) TP1.1 U2.1(PWRKEY)
RI: U2.4(RI) U7.19(A1)
RST: C1.1 ESP1.45(EN) R1.1 SW1.2
RTS: U2.8(RTS) U7.5(A6)
RXD: U2.10(RXD) U7.6(A7)
SIM_CLK: CARD1.C3(CLK) D3.3 R30.2 U5.6(CLK)
SIM_DATA: CARD1.C7(I/O) D3.1 R32.2 U5.3(I/O)
SIM_RST: CARD1.C2(RST) D3.4 R31.2 U5.7(RST)
SPK_N: C31.2 R14.1
SPK_P: C30.2 R13.1
SPK_SD: R40.2 U2.48(GPIO3)
TP2: C6.1 R17.1 R18.2 U2.51(VBAT_ADC)
TP18: U2.53(GPIO4)
TXD: U2.9(TXD) U7.7(A8)
USB_N: ESP1.23(IO19) R8.2
USB_P: ESP1.24(IO20) R7.2
USIM_CLK: C13.1 R30.1 U2.32(USIM1_CLK)
USIM_DATA: C15.1 R32.1 U2.31(USIM1_DATA)
USIM_RST: C14.1 R31.1 U2.33(USIM1_RST)
USIM_VDD: C11.1 C12.1 C16.1 CARD1.C1(VCC) D3.5 U2.30(USIM1_VDD) U5.8(VDD)
Net-(C7-1): C7.1 CN1.2 D2.1(C) R20.1 U2.116(GNSS_VBKP)
Net-(C8-2): C8.2 L2.1 U2.97(1V8_GNSS)
Net-(C9-1): C9.1 L3.2 RF3.2(CONT) U4.2(A)
Net-(C9-2): C9.2 U2.90(GNSS_ANT)
Net-(C10-2): C10.2 L3.1 R22.1 R23.1
Net-(C25-1): C25.1 C26.1 U6.1(OUT)
Net-(C30-1): C30.1 R38.1
Net-(C31-1): C31.1 R39.1
Net-(C32-1): C32.1 U8.2(Bypass)
Net-(C35-1): C35.1 CN2.1 L4.2
Net-(C36-1): C36.1 CN2.2 L5.2
Net-(C37-2): C37.2 C38.1 C40.2 C41.1 CN3.1 L6.2
Net-(C38-2): C38.2 C39.1 C41.2 C42.1 CN3.2 L7.2
Net-(D1-1): D1.1(I/O1) R7.1
Net-(D1-3): D1.3(I/O2) R8.1
Net-(D1-4): D1.4(I/O2) USB2.A7(DN1) USB2.B7(DN2)
Net-(D1-6): D1.6(I/O1) USB2.A6(DP1) USB2.B6(DP2)
Net-(L1-1): L1.1 U1.3(LX)
Net-(L4-1): L4.1 U8.5(VON)
Net-(L5-1): L5.1 U8.8(VoP)
Net-(LED1-1): LED1.1(A) R12.1
Net-(LED2-1): LED2.1(A) R19.1
Net-(LED3-1): LED3.1(A) R24.1
Net-(LED4-1): LED4.1(A) R27.1
Net-(Q1-1): Q1.1(B) R25.2 R26.1
Net-(Q2-1): Q2.1(B) R28.2 R29.1
Net-(R4-2): R4.2 USB2.B5(CC2)
Net-(R6-2): R6.2 USB2.A5(CC1)
Net-(R9-1): R9.1 R10.2 U1.5(FB)
Net-(R13-2): R13.2 U2.40(EAR_P)
Net-(R14-2): R14.2 U2.41(EAR_N)
Net-(R15-2): R15.2 U2.49(UART3_RXD)
Net-(R16-2): R16.2 U2.50(UART3_TXD)
Net-(R19-2): R19.2 U2.52(NETLIGHT)
Net-(R21-1): R21.1 U2.98(GNSS_PWRCTL)
Net-(R24-2): R24.2 U2.66(STATUS)
Net-(R34-1): R34.1 U7.15(B3)
Net-(R35-1): R35.1 U7.14(B4)
Net-(R36-1): R36.1 U7.13(B5)
Net-(R37-1): R37.1 U7.12(B6)
Net-(R38-2): R38.2 U8.3(INP)
Net-(R39-2): R39.2 U8.4(INN)
Net-(R40-1): R40.1 R41.1 U8.1(CTRL)
Net-(R43-2): R43.2 USB3.B5(CC2)
Net-(R44-2): R44.2 USB3.A5(CC1)
Net-(RF1-2): RF1.2(CONT) U2.60(RF_ANT)
Net-(RF3-1): RF3.1(GND) U4.1(C)
Net-(RF4-2): RF4.2(CONT) U2.93(BT_ANT) U3.2(A)
Net-(SW3-2): SW3.2 U2.6(USB_BOOT●)
Net-(TP2-1): TP2.1 U2.11(SPI_CLK)
Net-(TP3-1): TP3.1 U2.12(SPI_CS)
Net-(TP4-1): TP4.1 U2.13(SPI_MOSI)
Net-(TP5-1): TP5.1 U2.14(SPI_MISO)
Net-(TP6-1): TP6.1 U2.21(MK_OUT_3)
Net-(TP7-1): TP7.1 U2.26(GPIO2)
Net-(TP8-1): TP8.1 U2.35(MK_OUT_6/I2C3_SDA)
Net-(TP9-1): TP9.1 U2.36(MK_IN_6/I2C3_SCL)
Net-(TP10-1): TP10.1 U2.68(MK_IN_5)
Net-(TP11-1): TP11.1 U2.67(MK_OUT_5)

Not connected (* = marked no-connect by the designer): C35 2; C36 2; CARD1 1 2 C6(VPP)*; ESP1 1(GND) 2(GND) 3(3V3) 5(IO1) 6(IO2) 7(IO3) 8(IO4) 9(IO5) 10(IO6) 11(IO7) 12(IO8) 13(IO9) 14(IO10) 15(IO11) 16(IO12) 17(IO13) 18(IO14) 19(IO15) 20(IO16) 21(IO17) 22(IO18) 25(IO21) 26(IO26) 27(IO47) 28(IO33) 29(IO34) 30(IO48) 31(IO35) 32(IO36) 33(IO37) 34(IO38) 35(IO39) 36(IO40) 37(IO41) 38(IO42) 39(TXD0) 40(RXD0) 41(IO45) 42(GND) 43(GND) 44(IO46) 46(GND) 47(GND) 48(GND) 49(GND) 50(GND) 51(GND) 52(GND) 53(GND) 54(GND) 55(GND) 56(GND) 57(GND) 58(GND) 59(GND) 60(GND) 61(GND) 62(GND) 63(GND) 64(GND) 65(GND); Q3 1(S1) 2(G1) 3(D2) 4(S2) 5(G2) 6(D1) 7(D1) 8(D2); RF4 3(GND); SW4 1 2 3; U2 5(DCD)* 16(RESET)* 22(UART_LOG_RX)* 23(UART_LOG_TX)* 25(ADC)* 34(USIM1_DET)* 37(I2C_SDA)* 38(I2C_SCL)* 44(MK_OUT_2)* 47(MK_IN_2)* 101(LCD_BL_PWM)* 102(LCD_SPI_CLK)* 103(LCD_SPI_TXD)* 104(LCD_SPI_RXD)* 105(LCD_SPI_CS)* 106(LCD_RST)* 107(LCD_DCX)* 108(USIM2_DATA)* 109(USIM2_CLK)* 110(USIM2_VDD)* 111(USIM2_RST)* 112(USIM2_DET)* 113(NC)* 114(NC)* 115(NC)* 117(CAM_I2C_SDA)* 118(CAM_I2C_SCL)* 119(CAM_PWDN)* 120(CAM_RST)* 121(CAM_MCLK)* 122(CAM_SPI_D0)* 123(CAM_SPI_D1)* 124(CAM_SPI_CLK)*; U5 2(NULL) 4(NULL)* 5(NULL)*; U9 1(TEMP) 2(ISET) 3(GND) 4(VIN) 5(BAT) 6(DONE#) 7(CHRG#) 8(FB) 9(PAD); U10 1(PCKP) 2(PCKN) 3(PCKN) 4(BATN) 5(BATN) 6(BYPS) 7(NC); U11 1(GND) 2(Vout) 3(Vin); U12 1(VINA) 2(GND) 3(FB) 4(VOUT) 5(VOUT) 6(L2) 7(L2) 8(L1) 9(L1) 10(VIN) 11(VIN) 12(EN) 13(PS/SYNC) 14(PG) 15(PGND); U13 1(EN) 2(GND) 3(LX) 4(IN) 5(FB); USB2 A8(SBU1)* B8(SBU2)*; USB3 A8(SBU1)* B8(SBU2)*; USB4 13(EH) 14(EH) A1B12(GND) A4B9(VBUS) A5(CC1) A6(Dp1) A7(Dn1) A8(SBU1) B1A12(GND) B4A9(VBUS) B5(CC2) B6(Dp2) B7(Dn2) B8(SBU2)

## Notes on the sheets
sheet 1
- D+
- D-
- RESET
- USB 2.0
- Inductor SMD (1uF-2.2uF, high current)
- ESP32-S3-MINI-1U-N4R2
- BOOT
- Vout = Vref * (1 + R9/R10)
  Vref = 0.6V (SY8089A)
- BUCK CONVERTER
sheet 2
- Tantalum cap
- TAJB107M010RNJ
- TAJB107M010RNJ
- NC
- JP1
- JP2
- JP3
- JP4
- NC
- Product brief: https://and-global.com/list_23/651.html
  SIM7670 Series Hardware Design: https://www.simcom.com/product/A7670X.html
  Main Doc: https://github.com/Xinyuan-LILYGO/LilyGo-Modem-Series/blob/main/docs/en/esp32s3/sim7670g-s3-standard/README.MD
